# Altium schematic sheet NODE_Module.SchDoc: Node Module (Parent Sheet)
size B; CompanyName: OUTATIME; DrawnBy: Brad Yuska; Engineer: Brad Yuska; Revision: 1
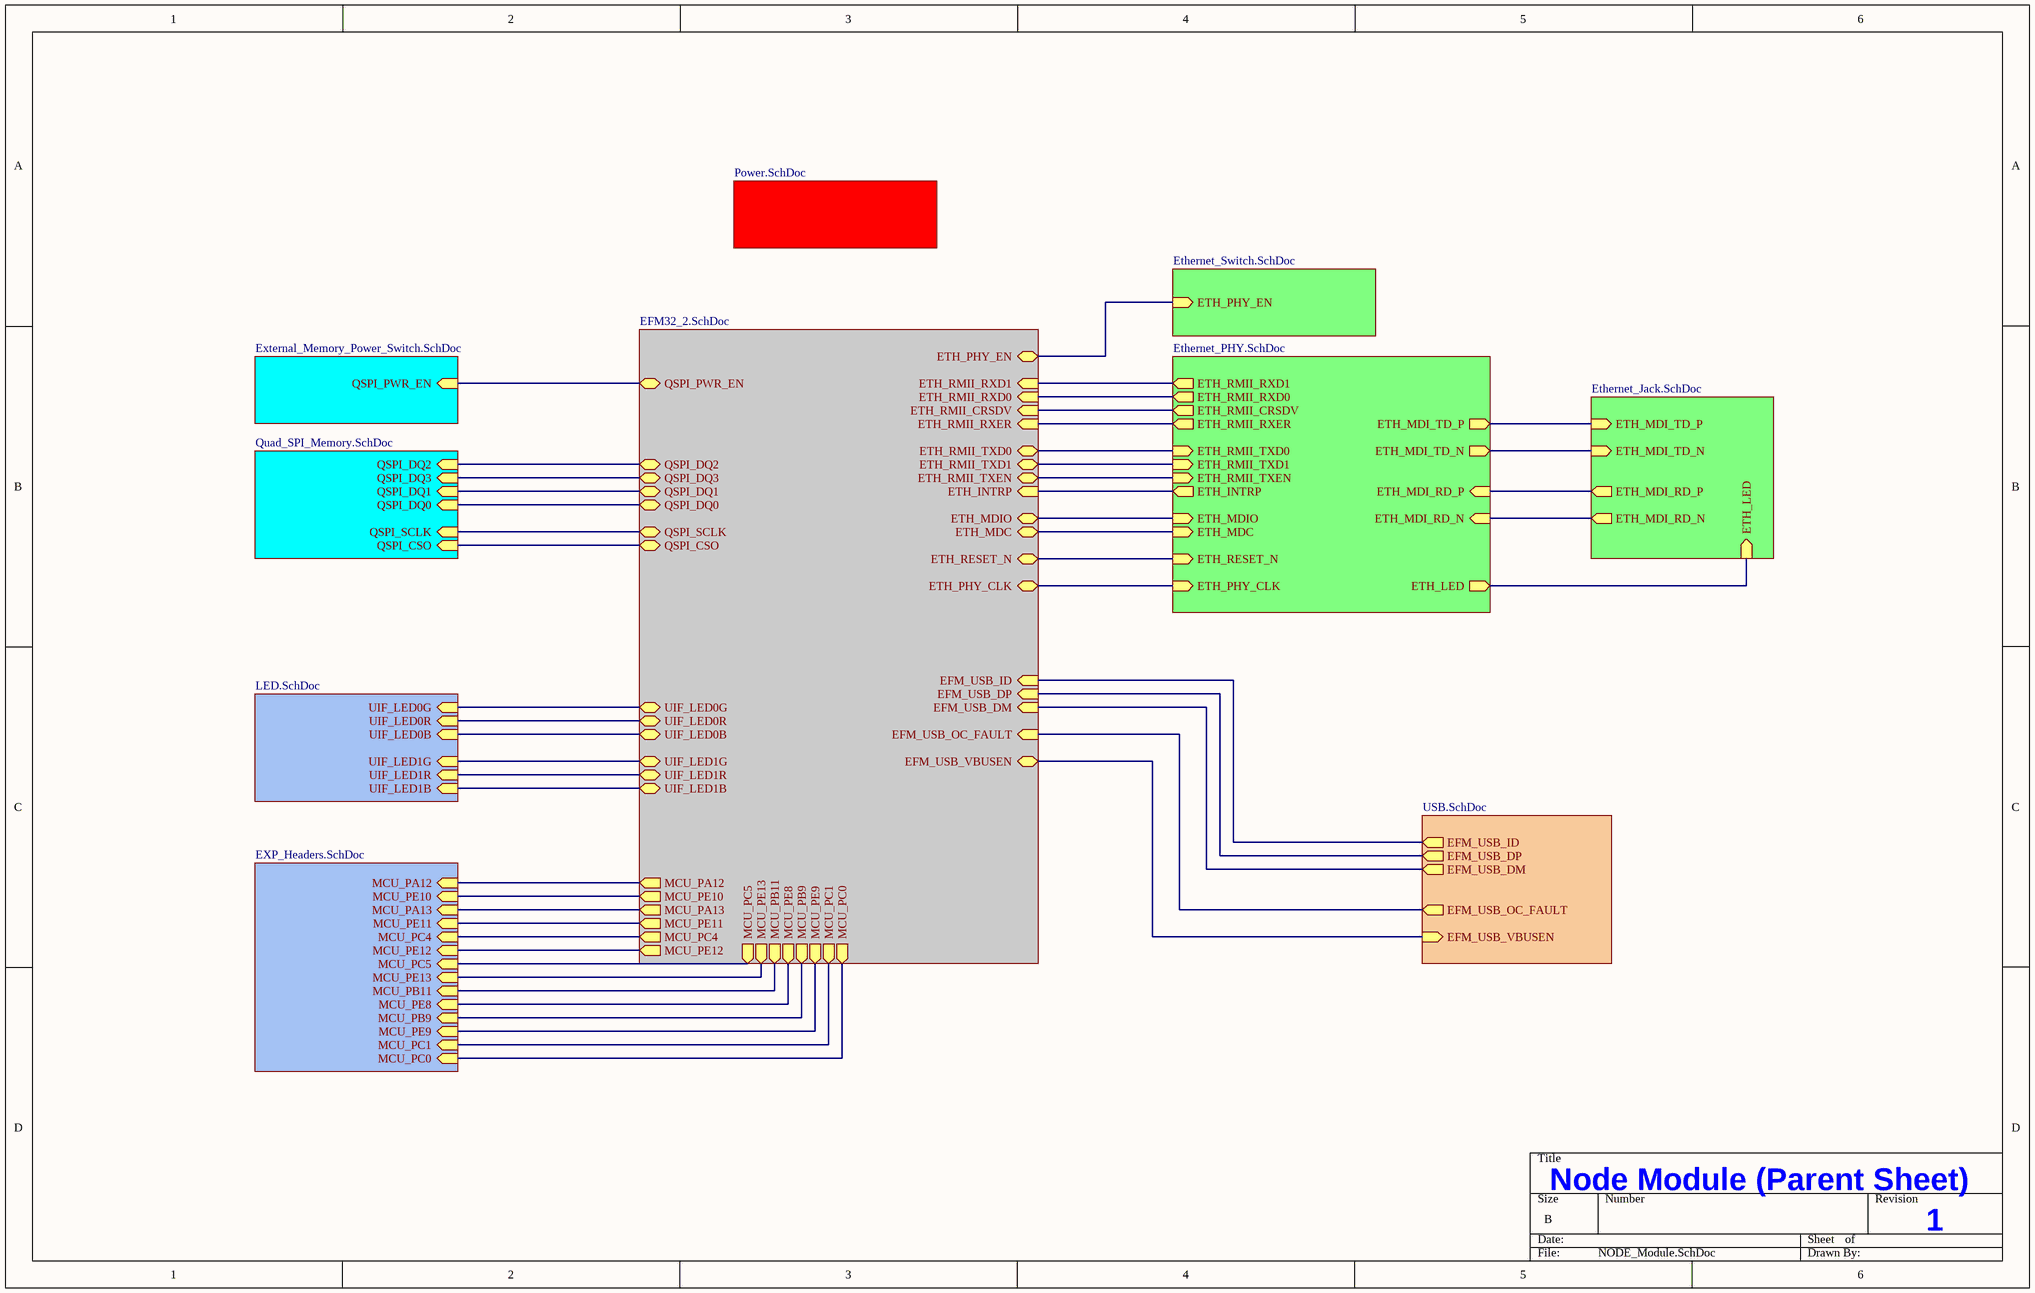
[diagram p0: NODE_Module.SchDoc]

## Sub-sheets
U_EFM32_2 = EFM32_2.SchDoc: QSPI_CSO (bidir), QSPI_DQ0 (bidir), QSPI_DQ1 (bidir), QSPI_DQ2 (bidir), QSPI_DQ3 (bidir), MCU_PC0 (out), MCU_PC1 (out), MCU_PC4 (out), MCU_PC5 (out), MCU_PA12 (out), MCU_PA13 (out), MCU_PB9 (out), MCU_PB11 (out), MCU_PE13 (out), MCU_PE12 (out), MCU_PE11 (out), MCU_PE10 (out), MCU_PE9 (out), MCU_PE8 (out), ETH_RMII_RXER (in), ETH_RMII_CRSDV (in), ETH_PHY_CLK (bidir), ETH_RMII_RXD0 (in), ETH_RMII_RXD1 (in), ETH_RMII_TXEN (bidir), ETH_RMII_TXD0 (bidir), ETH_RMII_TXD1 (bidir), EFM_USB_VBUSEN (bidir), EFM_USB_ID (in), ETH_INTRP (in), EFM_USB_DP (in), EFM_USB_DM (in), QSPI_SCLK (bidir), ETH_MDC (bidir), ETH_MDIO (bidir), ETH_PHY_EN (bidir), EFM_USB_OC_FAULT (in), UIF_LED0G (bidir), UIF_LED1R (bidir), UIF_LED0B (bidir), UIF_LED1G (bidir), UIF_LED1B (bidir), UIF_LED0R (bidir), ETH_RESET_N (bidir), QSPI_PWR_EN (bidir)
U_Ethernet_Jack = Ethernet_Jack.SchDoc: ETH_MDI_TD_P (in), ETH_MDI_TD_N (in), ETH_MDI_RD_P (out), ETH_MDI_RD_N (out), ETH_LED (in)
U_Ethernet_PHY = Ethernet_PHY.SchDoc: ETH_MDI_RD_N (in), ETH_MDI_RD_P (in), ETH_MDI_TD_N (out), ETH_MDI_TD_P (out), ETH_RESET_N (in), ETH_LED (out), ETH_INTRP (out), ETH_RMII_TXD1 (in), ETH_RMII_TXD0 (in), ETH_RMII_TXEN (in), ETH_RMII_RXD1 (out), ETH_RMII_RXD0 (out), ETH_RMII_RXER (out), ETH_RMII_CRSDV (out), ETH_PHY_CLK (in), ETH_MDIO (in), ETH_MDC (in)
U_Ethernet_Switch = Ethernet_Switch.SchDoc: ETH_PHY_EN (in)
U_EXP_Headers = EXP_Headers.SchDoc: MCU_PA12 (in), MCU_PE10 (in), MCU_PA13 (in), MCU_PE11 (in), MCU_PC4 (in), MCU_PE12 (in), MCU_PC5 (in), MCU_PE13 (in), MCU_PB11 (in), MCU_PE8 (in), MCU_PB9 (in), MCU_PE9 (in), MCU_PC1 (in), MCU_PC0 (in)
U_External_Memory_Power_Switch = External_Memory_Power_Switch.SchDoc: QSPI_PWR_EN (in)
U_LED = LED.SchDoc: UIF_LED0G (in), UIF_LED0R (in), UIF_LED0B (in), UIF_LED1G (in), UIF_LED1R (in), UIF_LED1B (in)
U_Power = Power.SchDoc: no entries
U_Quad_SPI_Memory = Quad_SPI_Memory.SchDoc: QSPI_DQ2 (in), QSPI_DQ3 (in), QSPI_DQ1 (in), QSPI_DQ0 (in), QSPI_SCLK (in), QSPI_CSO (in)
U_USB = USB.SchDoc: EFM_USB_VBUSEN (in), EFM_USB_OC_FAULT (out), EFM_USB_ID (out), EFM_USB_DP (out), EFM_USB_DM (out)

## Nets
(unnamed): sheet U_Ethernet_Jack/ETH_MDI_TD_P, sheet U_Ethernet_PHY/ETH_MDI_TD_P
(unnamed): sheet U_Ethernet_Jack/ETH_MDI_TD_N, sheet U_Ethernet_PHY/ETH_MDI_TD_N
(unnamed): sheet U_Ethernet_Jack/ETH_MDI_RD_P, sheet U_Ethernet_PHY/ETH_MDI_RD_P
(unnamed): sheet U_Ethernet_Jack/ETH_MDI_RD_N, sheet U_Ethernet_PHY/ETH_MDI_RD_N
(unnamed): sheet U_Ethernet_Jack/ETH_LED, sheet U_Ethernet_PHY/ETH_LED
(unnamed): sheet U_Ethernet_Switch/ETH_PHY_EN, sheet U_EFM32_2/ETH_PHY_EN
(unnamed): sheet U_Quad_SPI_Memory/QSPI_DQ2, sheet U_EFM32_2/QSPI_DQ2
(unnamed): sheet U_Quad_SPI_Memory/QSPI_DQ3, sheet U_EFM32_2/QSPI_DQ3
(unnamed): sheet U_Quad_SPI_Memory/QSPI_DQ1, sheet U_EFM32_2/QSPI_DQ1
(unnamed): sheet U_Quad_SPI_Memory/QSPI_DQ0, sheet U_EFM32_2/QSPI_DQ0
(unnamed): sheet U_Quad_SPI_Memory/QSPI_SCLK, sheet U_EFM32_2/QSPI_SCLK
(unnamed): sheet U_Quad_SPI_Memory/QSPI_CSO, sheet U_EFM32_2/QSPI_CSO
(unnamed): sheet U_External_Memory_Power_Switch/QSPI_PWR_EN, sheet U_EFM32_2/QSPI_PWR_EN
(unnamed): sheet U_USB/EFM_USB_VBUSEN, sheet U_EFM32_2/EFM_USB_VBUSEN
(unnamed): sheet U_USB/EFM_USB_OC_FAULT, sheet U_EFM32_2/EFM_USB_OC_FAULT
(unnamed): sheet U_USB/EFM_USB_ID, sheet U_EFM32_2/EFM_USB_ID
(unnamed): sheet U_USB/EFM_USB_DP, sheet U_EFM32_2/EFM_USB_DP
(unnamed): sheet U_USB/EFM_USB_DM, sheet U_EFM32_2/EFM_USB_DM
(unnamed): sheet U_EXP_Headers/MCU_PA12, sheet U_EFM32_2/MCU_PA12
(unnamed): sheet U_EXP_Headers/MCU_PE10, sheet U_EFM32_2/MCU_PE10
(unnamed): sheet U_EXP_Headers/MCU_PA13, sheet U_EFM32_2/MCU_PA13
(unnamed): sheet U_EXP_Headers/MCU_PE11, sheet U_EFM32_2/MCU_PE11
(unnamed): sheet U_EXP_Headers/MCU_PC4, sheet U_EFM32_2/MCU_PC4
(unnamed): sheet U_EXP_Headers/MCU_PE12, sheet U_EFM32_2/MCU_PE12
(unnamed): sheet U_EXP_Headers/MCU_PC5, sheet U_EFM32_2/MCU_PC5
(unnamed): sheet U_EXP_Headers/MCU_PE13, sheet U_EFM32_2/MCU_PE13
(unnamed): sheet U_EXP_Headers/MCU_PB11, sheet U_EFM32_2/MCU_PB11
(unnamed): sheet U_EXP_Headers/MCU_PE8, sheet U_EFM32_2/MCU_PE8
(unnamed): sheet U_EXP_Headers/MCU_PB9, sheet U_EFM32_2/MCU_PB9
(unnamed): sheet U_EXP_Headers/MCU_PE9, sheet U_EFM32_2/MCU_PE9
(unnamed): sheet U_EXP_Headers/MCU_PC1, sheet U_EFM32_2/MCU_PC1
(unnamed): sheet U_EXP_Headers/MCU_PC0, sheet U_EFM32_2/MCU_PC0
(unnamed): sheet U_LED/UIF_LED0G, sheet U_EFM32_2/UIF_LED0G
(unnamed): sheet U_LED/UIF_LED0R, sheet U_EFM32_2/UIF_LED0R
(unnamed): sheet U_LED/UIF_LED0B, sheet U_EFM32_2/UIF_LED0B
(unnamed): sheet U_LED/UIF_LED1G, sheet U_EFM32_2/UIF_LED1G
(unnamed): sheet U_LED/UIF_LED1R, sheet U_EFM32_2/UIF_LED1R
(unnamed): sheet U_LED/UIF_LED1B, sheet U_EFM32_2/UIF_LED1B
(unnamed): sheet U_Ethernet_PHY/ETH_RESET_N, sheet U_EFM32_2/ETH_RESET_N
(unnamed): sheet U_Ethernet_PHY/ETH_INTRP, sheet U_EFM32_2/ETH_INTRP
(unnamed): sheet U_Ethernet_PHY/ETH_RMII_TXD1, sheet U_EFM32_2/ETH_RMII_TXD1
(unnamed): sheet U_Ethernet_PHY/ETH_RMII_TXD0, sheet U_EFM32_2/ETH_RMII_TXD0
(unnamed): sheet U_Ethernet_PHY/ETH_RMII_TXEN, sheet U_EFM32_2/ETH_RMII_TXEN
(unnamed): sheet U_Ethernet_PHY/ETH_RMII_RXD1, sheet U_EFM32_2/ETH_RMII_RXD1
(unnamed): sheet U_Ethernet_PHY/ETH_RMII_RXD0, sheet U_EFM32_2/ETH_RMII_RXD0
(unnamed): sheet U_Ethernet_PHY/ETH_RMII_RXER, sheet U_EFM32_2/ETH_RMII_RXER
(unnamed): sheet U_Ethernet_PHY/ETH_RMII_CRSDV, sheet U_EFM32_2/ETH_RMII_CRSDV
(unnamed): sheet U_Ethernet_PHY/ETH_PHY_CLK, sheet U_EFM32_2/ETH_PHY_CLK
(unnamed): sheet U_Ethernet_PHY/ETH_MDIO, sheet U_EFM32_2/ETH_MDIO
(unnamed): sheet U_Ethernet_PHY/ETH_MDC, sheet U_EFM32_2/ETH_MDC